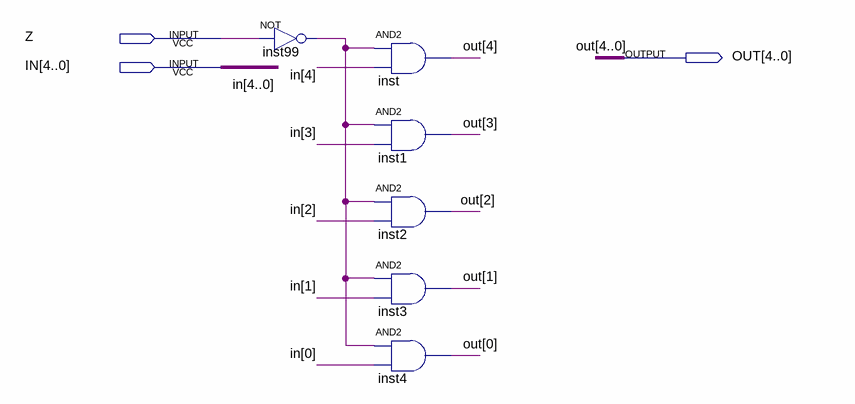
[diagram p0: schematic sheet]
// Quartus schematic Zera.bdf as structural Verilog: 6 symbols, 3 pins
module Zera (
  input  Z,
  input  [4:0] IN,
  output [4:0] OUT
);

  wire inst99_out;

  not inst99 (inst99_out, Z);
  and inst (OUT[4], inst99_out, IN[4]);
  and inst1 (OUT[3], inst99_out, IN[3]);
  and inst2 (OUT[2], inst99_out, IN[2]);
  and inst3 (OUT[1], inst99_out, IN[1]);
  and inst4 (OUT[0], inst99_out, IN[0]);
endmodule
